# EAGLE design electrosteel2020_block (EAGLE 9.2.2)
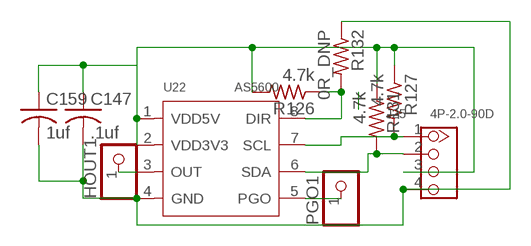
[diagram p0: schematic, sheet 1]

## Parts
C147  .1uf  C-USC0603K  [C0603K]
C159  1uf  C-USC1206K  [C1206K]
HOUT1  PINHD-1X1  [1X01]
J25  4P-2.0-90D  GROVE-CONNECTOR-DIP-90D(4P-2.0)  [HW4-2.0-90D]
PGO1  PINHD-1X1  [1X01]
R126  4.7k  R-US_R0603  [R0603]
R127  4.7k  R-US_R0603  [R0603]
R131  4.7k  R-US_R0603  [R0603]
R132  0R_DNP  R-US_R0603  [R0603]
U22  AS5600  SENSOR-AS5600  [SOIC8-1.27-5X4MM]

## Nets
N$152: R126.1 R132.2 U22.8(DIR)
N$154: J25.2 R131.2 U22.6(SDA)
N$155: J25.1 R127.2 U22.7(SCL)
N$156: C147.1 C159.1 J25.3 R126.2 R127.1 R131.1 U22.1(VDD5V) U22.2(VDD3V3)
N$157: C147.2 C159.2 J25.4 R132.1 U22.4(GND)
N$158: PGO1.1 U22.5(PGO)
N$161: HOUT1.1 U22.3(OUT)

## Library data of the parts
C147 = adafruit:C-US: CAPACITOR, American symbol; PARTNO: CC0603KRX7R8BB104
C159 = adafruit:C-US: CAPACITOR, American symbol; PARTNO: C3216X7R1E105K085AA
HOUT1 PGO1 = adafruit:PINHD-1X1: Pin header 1x1 for 0.1" spacing With round pins; PARTNO: *DNP
J25 = OPL_Connector:GROVE-CONNECTOR-DIP-90D(4P-2.0): 320110034
R126 R127 R131 R132 = Resistor:R-US_: RESISTOR, American symbol; PARTNO: ESR03EZPJ470
U22 = Sensor:SENSOR-AS5600

## Board
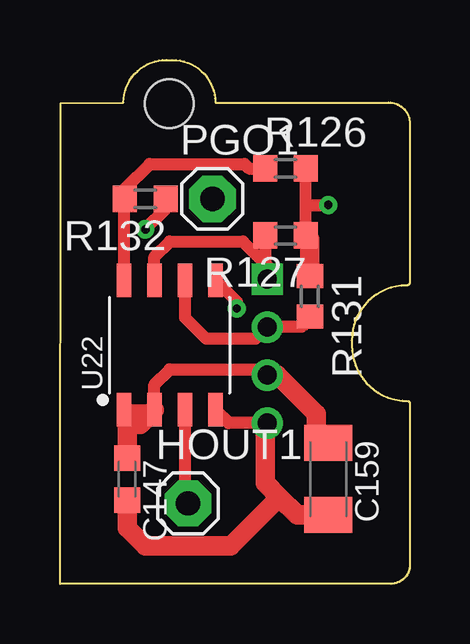
[diagram p1: board, top side]
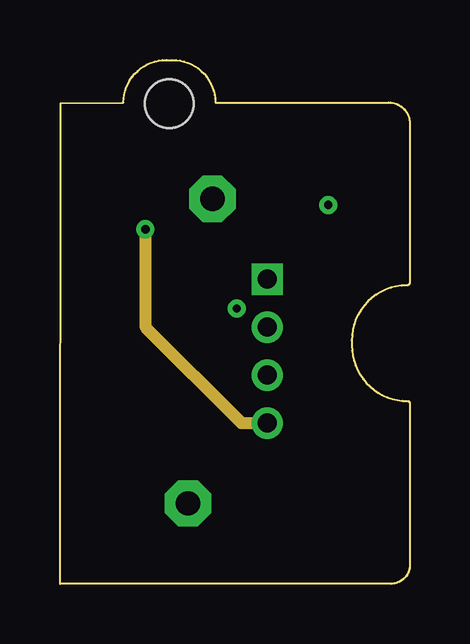
[diagram p2: board, inner layer Route2]
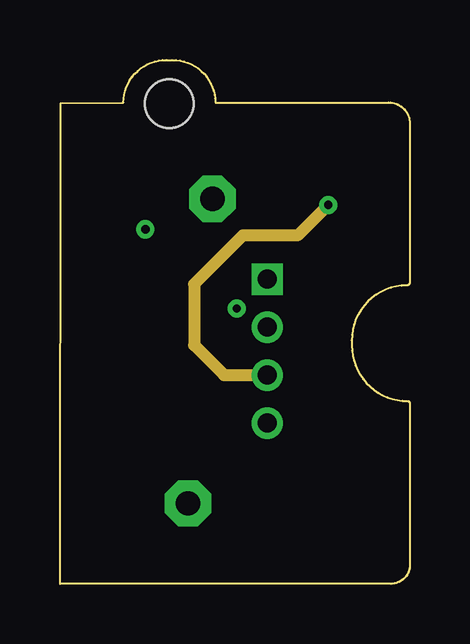
[diagram p3: board, inner layer Route15]
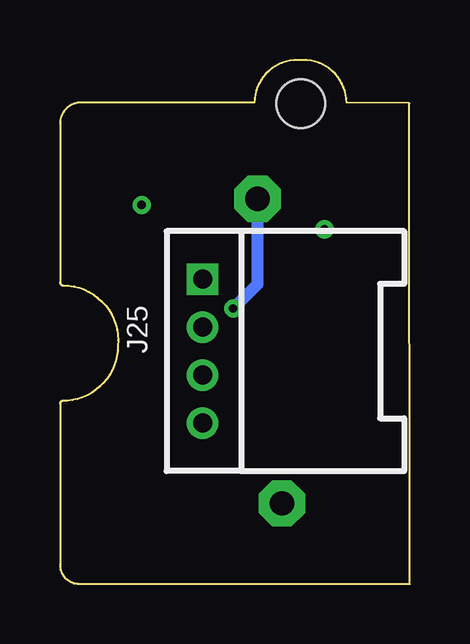
[diagram p4: board, bottom side, seen from below]

Size 14.58 x 21.84 mm. Coordinates in mm from the lower left corner, seen from the top.
Outline: 2.64,20.07 arc-90 4.45,21.84 4.67,21.84 arc-90 6.48,20.07 13.69,20.07 arc-90 14.58,19.2 14.58,12.57 arc-90 14.45,12.45 arc95 12.17,9.93 arc90 14.48,7.62 arc-90 14.58,7.52 14.58,0.79 arc-90 13.79,0 0,0 0.03,20.04 2.64,20.07
Copper layers (1+2*15+16): Top 0.035mm / dielectric 0.5mm / Route2 0.035mm / dielectric 0.5mm / Route15 0.035mm / dielectric 0.5mm / Bottom 0.035mm
Design rules "default *": minimum track width 6mil, minimum drill 0.35mm, track to track 9mil, track to pad 9mil, pad to pad 9mil, via to via 9mil, smd to smd 9mil, copper to edge 40mil, drill to drill 6mil, minimum pad ring 10mil, minimum via ring 8mil, stop-mask expansion 4mil, vias tented up to drill 0mil, thermal gap 10mil
Holes 2.03 mm at 4.55,20.02

### Footprints (pad centres in the part's own frame; a part is rotated, then mirrored left to right if it is on the bottom)
C0603K = smd 1.05 x 1.08: 1 -0.875,0; 2 0.875,0
C1206K = smd 1.5 x 2: 1 -1.5,0; 2 1.5,0
1X01 = drill 1.016 pad 1.93 octagon: 1 0,0
HW4-2.0-90D = drill 0.8 pad 1.27 square: 1 -3,0 | drill 0.8 pad 1.27: 2 -1,0; 3 1,0; 4 3,0
R0603 = smd 1 x 1.1: 1 -0.85,0; 2 0.85,0
SOIC8-1.27-5X4MM = smd 0.6 x 1.4: 1 -1.905,-2.7; 2 -0.635,-2.7; 3 0.635,-2.7; 4 1.905,-2.7; 5 1.905,2.7; 6 0.635,2.7; 7 -0.635,2.7; 8 -1.905,2.7

### Placement (x,y rotation side)
C147  2.79,4.37 270 top
C159  11.18,4.37 270 top
HOUT1  5.33,3.35 0 top
J25  8.64,9.7 270 bottom
PGO1  6.35,16.05 0 top
R126  9.4,17.32 0 top
R127  9.4,14.53 180 top
R131  10.41,11.99 270 top
R132  3.56,16.05 180 top
U22  4.57,9.96 0 top

### Tracks (layer width: path | path; a pad name or v marks a point on that pad's centre or on a via)
N$152
  Top 0.508: U22.8 2.67,16.01 R132.2 2.71,16.47 3.73,17.5 7.7,17.5 7.87,17.32 R126.1
N$154
  Top 0.508: U22.6 5.21,11.1 6.1,10.21 8.14,10.21 J25.2 8.62,10.72 10.07,10.72 R131.2
N$155
  Top 0.508: U22.7 3.94,13.64 4.57,14.27 7.62,14.27 8.64,13.26 | 8.64,13.26 J25.1 | 8.64,13.26 8.55,13.17 R127.2
N$156  (via drill 0.35)
  Top 0.508: U22.1 U22.2 3.94,8.31 4.57,8.94 8.4,8.94 J25.3 9.05,8.7 | R127.1 10.25,15.8 | 10.25,15.8 R126.2 | 10.25,15.8 v11.18,15.8
  Top 0.813: R127.1 10.41,14.36 R131.1 | U22.2 3.33,6.65 2.79,6.65 C147.1 | 9.05,8.7 10.67,7.08 10.67,6.38 C159.1
  Route15 0.508: v11.18,15.8 9.91,14.53 7.62,14.53 5.59,12.5 5.59,9.96 6.84,8.7 J25.3
N$157  (via drill 0.35)
  Top 0.508: J25.4 7.03,6.7 U22.4 | R132.1 4.41,15.63 v3.56,14.78
  Top 0.813: J25.4 8.54,6.61 8.54,4.21 9.14,3.61 | C159.2 9.88,2.87 9.14,3.61 | C147.2 2.79,2.34 3.56,1.57 7.11,1.57 9.14,3.61
  Route2 0.508: v3.56,14.78 3.56,10.72 7.57,6.7 J25.4
N$158  (via drill 0.35)
  Top 0.508: U22.5 7.37,11.77 v7.37,11.48
  Bottom 0.508: v7.37,11.48 6.35,12.5 PGO1.1
N$161
  Top 0.508: U22.3 5.21,3.48 HOUT1.1